# EAGLE design goodfetrep20 (EAGLE 5.04)
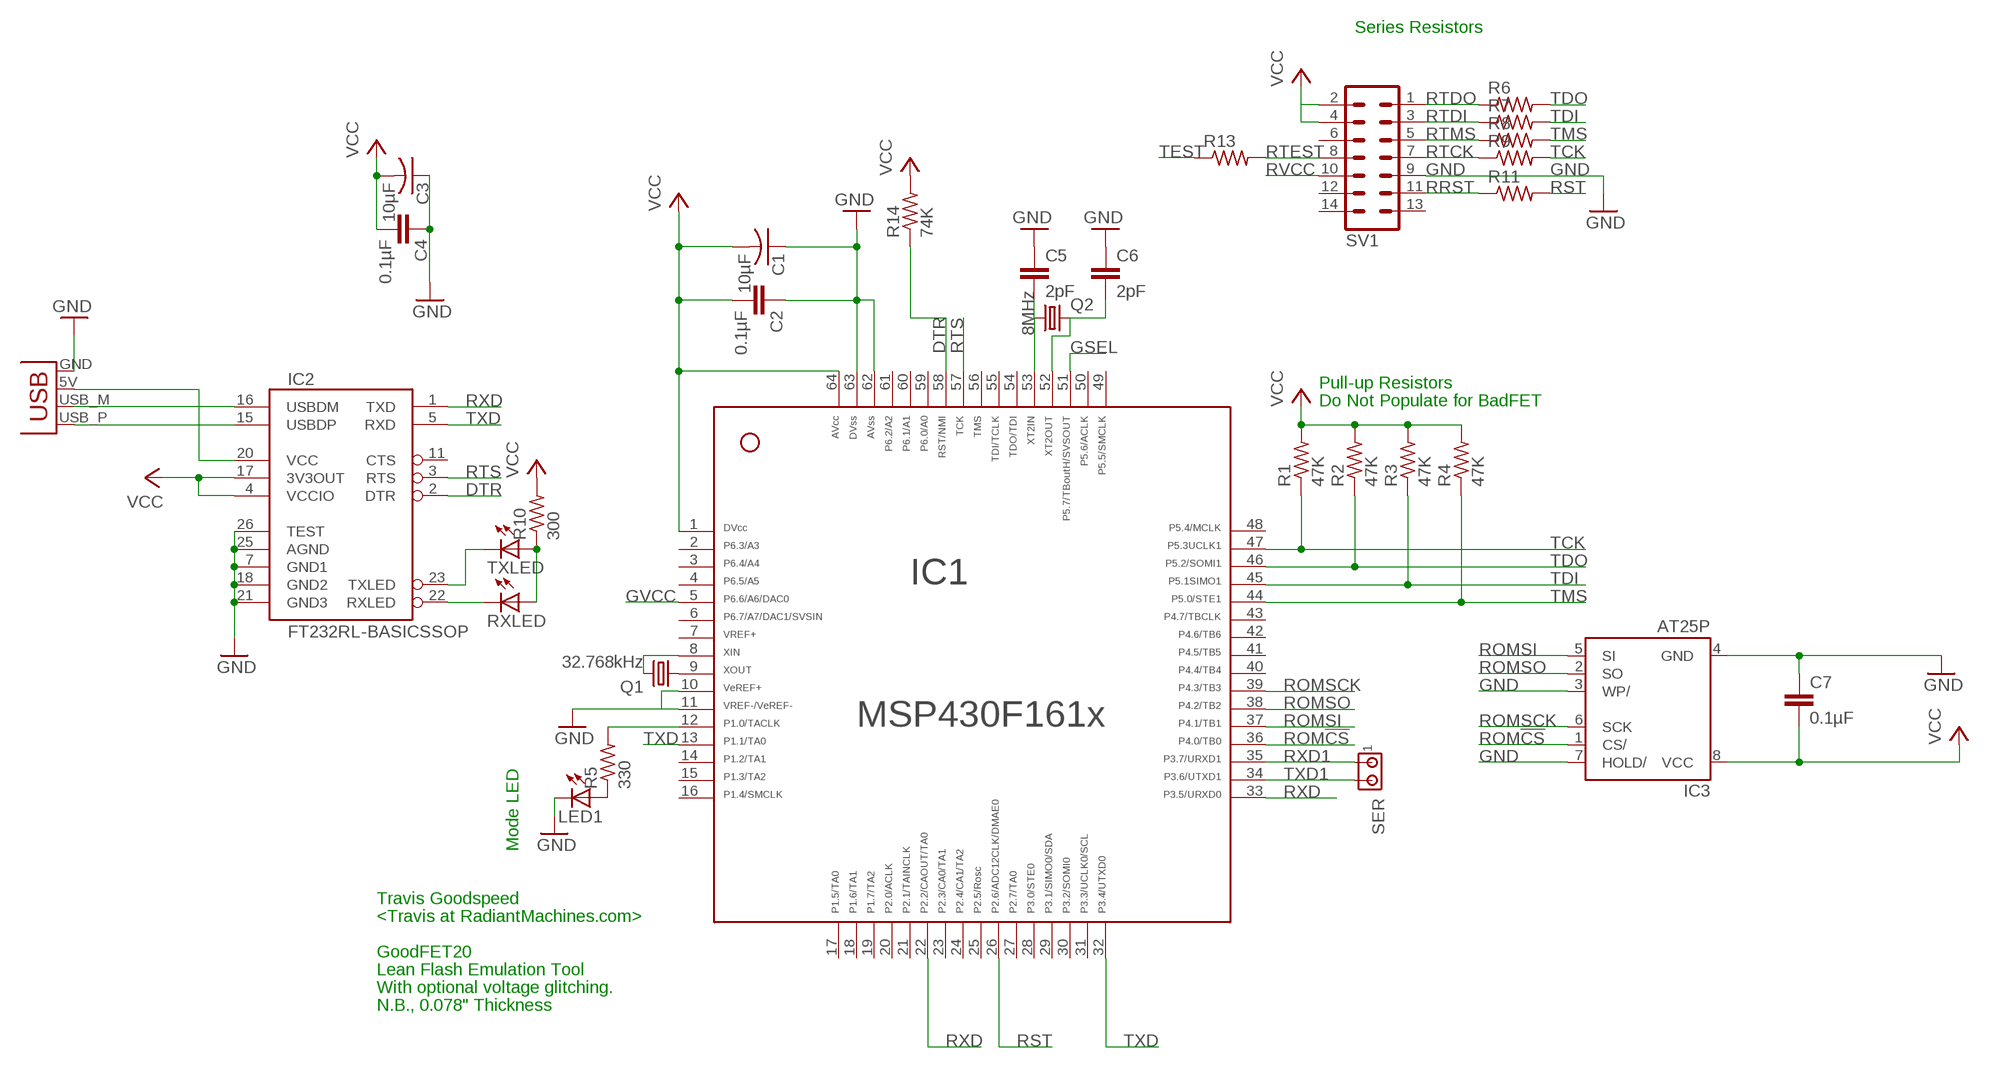
[diagram p0: schematic, sheet 1]

## Parts
C1  10µF  C-USC0603  [C0603]
C2  0.1µF  C-EUC0603  [C0603]
C3  10µF  C-USC0603  [C0603]
C4  0.1µF  C-EUC0603  [C0603]
C5  2pF  C-EUC0603  [C0603]
C6  2pF  C-EUC0603  [C0603]
C7  0.1µF  C-EUC0603  [C0603]
IC1  F161X---PM64  [PM/PAG64]
IC2  FT232RL-BASICSSOP  [SSOP28DB]
IC3  AT25P  [DIL08]
LED1  LEDCHIP-LED0603  [CHIP-LED0603]
Q1  32.768kHz  CRYSTALTC26V  [TC26V]
Q2  8MHz  CRYSTALTC26V  [TC26V]
R1  47K  R-US_R0603  [R0603]
R2  47K  R-US_R0603  [R0603]
R3  47K  R-US_R0603  [R0603]
R4  47K  R-US_R0603  [R0603]
R5  330  R-US_R0603  [R0603]
R6  R-US_R0603  [R0603]
R7  R-US_R0603  [R0603]
R8  R-US_R0603  [R0603]
R9  R-US_R0603  [R0603]
R10  300  R-US_R0603  [R0603]
R11  R-US_R0603  [R0603]
R13  R-US_R0603  [R0603]
R14  74K  R-US_R0603  [R0603]
RXLED  LEDCHIP-LED0603  [CHIP-LED0603]
SER  MTA02-100  [10X02MTA]
SV1  MA07-2  [MA07-2]
TXLED  LEDCHIP-LED0603  [CHIP-LED0603]
X1  USBPCB  [USB-A-PCB]

## Nets
DTR: IC1.58 IC2.2(DTR) R14.1
GND: C1.1 C2.1 C3.1 C4.1 C5.1 C6.1 C7.1 IC1.10 IC1.11 IC1.62 IC1.63 IC2.7(GND1) IC2.18(GND2) IC2.21(GND3) IC2.25(AGND) IC2.26(TEST) IC3.3(WP/) IC3.4(GND) IC3.7(HOLD/) LED1.C SV1.9 X1.GND
GSEL: IC1.51
GVCC: IC1.5
N$1: IC1.12 R5.2
N$2: LED1.A R5.1
N$3: IC2.15(USBDP) X1.USB_P(D+)
N$4: IC2.16(USBDM) X1.USB_M(D-)
N$5: IC2.20(VCC) X1.5V(VBUS)
N$6: IC2.22(RXLED) RXLED.C
N$7: IC2.23(TXLED) TXLED.C
N$8: R10.1 RXLED.A TXLED.A
N$9: IC1.9 Q1.1
N$10: C5.2 IC1.53 Q2.1
N$14: C6.2 IC1.52 Q2.2
N$21: IC1.8 Q1.2
ROM!CS: IC1.36 IC3.1(CS/)
ROMSCK: IC1.39 IC3.6(SCK)
ROMSI: IC1.37 IC3.5(SI)
ROMSO: IC1.38 IC3.2(SO)
RRST: R11.1 SV1.11
RST: IC1.26 R11.2
RTCK: R9.1 SV1.7
RTDI: R7.1 SV1.3
RTDO: R6.1 SV1.1
RTEST: R13.2 SV1.8
RTMS: R8.1 SV1.5
RTS: IC1.57 IC2.3(RTS)
RVCC: SV1.10
RXD: IC1.22 IC1.33 IC2.1(TXD)
RXD1: IC1.35 SER.1
TCK: IC1.47 R1.1 R9.2
TDI: IC1.45 R3.1 R7.2
TDO: IC1.46 R2.1 R6.2
TEST: R13.1
TMS: IC1.44 R4.1 R8.2
TXD: IC1.13 IC1.32 IC2.5(RXD)
TXD1: IC1.34 SER.2
VCC: C1.2 C2.2 C3.2 C4.2 C7.2 IC1.1 IC1.64 IC2.4(VCCIO) IC2.17(3V3OUT) IC3.8(VCC) R1.2 R2.2 R3.2 R4.2 R10.2 R14.2 SV1.2 SV1.4
Unconnected: IC1.2 IC1.3 IC1.4 IC1.6 IC1.7 IC1.14 IC1.15 IC1.16 IC1.17 IC1.18 IC1.19 IC1.20 IC1.21 IC1.23 IC1.24 IC1.25 IC1.27 IC1.28 IC1.29 IC1.30 IC1.31 IC1.40 IC1.41 IC1.42 IC1.43 IC1.48 IC1.49 IC1.50 IC1.54 IC1.55 IC1.56 IC1.59 IC1.60 IC1.61 IC2.11(CTS) SV1.6 SV1.12 SV1.13 SV1.14

## Notes on the sheet
- Series Resistors
- Pull-up Resistors
- Do Not Populate for BadFET
- Mode LED
- Travis Goodspeed
- <Travis at RadiantMachines.com>
- GoodFET20
- Lean Flash Emulation Tool
- With optional voltage glitching.
- N.B., 0.078" Thickness

## Library data of the parts
C1 C3 = rcl:C-US: CAPACITOR, American symbol
C2 C4-C7 = rcl:C-EU: CAPACITOR, European symbol
IC1 = TI_MSP430_v122:F161X---PM64: *** MSP430F161x *** PM64
IC2 = SparkFun:FT232RL-BASIC: USB UART This is the simplified version of the FT232RL unit. Only what you need, nothing you don't. Spark Fun Electronics SKU : COM-00650
IC3 = atmel:AT25*: SPI bus serial EEPROM
LED1 RXLED TXLED = led:LED: LED OSRAM: - CHIPLED LG R971, LG N971, LY N971, LG Q971, LY Q971, LO R971, LY R971 LH N974, LH R974 LS Q976, LO Q976, LY Q976 LO Q996 - Hyper CHIPLED LW Q18S LB Q993, LB Q99A, LB R99A - SideLED LS A670, LO A670, LY A670, LG A670, LP A670 LB A673, LV A673, LT A673, LW A673 LH A674 LY A675 LS A676, LA A676, LO A676, LY A676, LW A676 LS A679, LY A679, LG A679 - Hyper Micro SIDELED® LS Y876, LA Y876, LO Y876, LY Y876 LT Y87S - SmartLED LW L88C, LW L88S LB L89C, LB L89S, LG L890 LS L89K, LO L89K, LY L89K LS L896, LA L896, LO L896, LY L896 - TOPLED LS T670, LO T670, LY T670, LG T670, LP T670 LSG T670, LSP T670, LSY T670, LOP T670, LYG T670 LG T671, LOG T671, LSG T671 LB T673, LV T673, LT T673, LW T673 LH T674 LS T676, LA T676, LO T676, LY T676, LB T676, LH T676, LSB T676, LW T676 LB T67C, LV T67C, LT T67C, LS T67K, LO T67K, LY T67K, LW E67C LS E67B, LA E67B, LO E67B, LY E67B, LB E67C, LV E67C, LT E67C LW T67C LS T679, LY T679, LG T679 LS T770, LO T770, LY T770, LG T770, LP T770 LB T773, LV T773, LT T773, LW T773 LH T774 LS E675, LA E675, LY E675, LS T675 LS T776, LA T776, LO T776, LY T776, LB T776 LHGB T686 LT T68C, LB T68C - Hyper Mini TOPLED® LB M676 - Mini TOPLED Santana® LG M470 LS M47K, LO M47K, LY M47K Source: http://www.osram.convergy.de LUXEON: - LUMILED® LXK2-PW12-R00, LXK2-PW12-S00, LXK2-PW14-U00, LXK2-PW14-V00 LXK2-PM12-R00, LXK2-PM12-S00, LXK2-PM14-U00 LXK2-PE12-Q00, LXK2-PE12-R00, LXK2-PE12-S00, LXK2-PE14-T00, LXK2-PE14-U00 LXK2-PB12-K00, LXK2-PB12-L00, LXK2-PB12-M00, LXK2-PB14-N00, LXK2-PB14-P00, LXK2-PB14-Q00 LXK2-PR12-L00, LXK2-PR12-M00, LXK2-PR14-Q00, LXK2-PR14-R00 LXK2-PD12-Q00, LXK2-PD12-R00, LXK2-PD12-S00 LXK2-PH12-R00, LXK2-PH12-S00 LXK2-PL12-P00, LXK2-PL12-Q00, LXK2-PL12-R00 Source: www.luxeon.com KINGBRIGHT: KA-3528ASYC Source: www.kingbright.com
Q1 Q2 = crystal:CRYSTAL: CRYSTAL
R1-R5 R10 R14 = rcl:R-US_: RESISTOR, American symbol
R6-R9 R11 R13 = resistor:R-US_: RESISTOR, American symbol
SER = con-amp:MTA02-100: AMP connector
SV1 = con-lstb:MA07-2: PIN HEADER
X1 = SparkFun:USB: USB Connectors USB-B-PTH is fully proven SKU : PRT-00139 USB-miniB is fully proven SKU : PRT-00587 USB-A-PCB is untested. USB-A-H is throughly reviewed, but untested. Spark Fun Electronics SKU : PRT-00437 USB-B-SMT is throughly reviewed, but untested. Needs silkscreen touching up. USB-A-S has not been used/tested USB-MB-H has not been used/tested

## Board
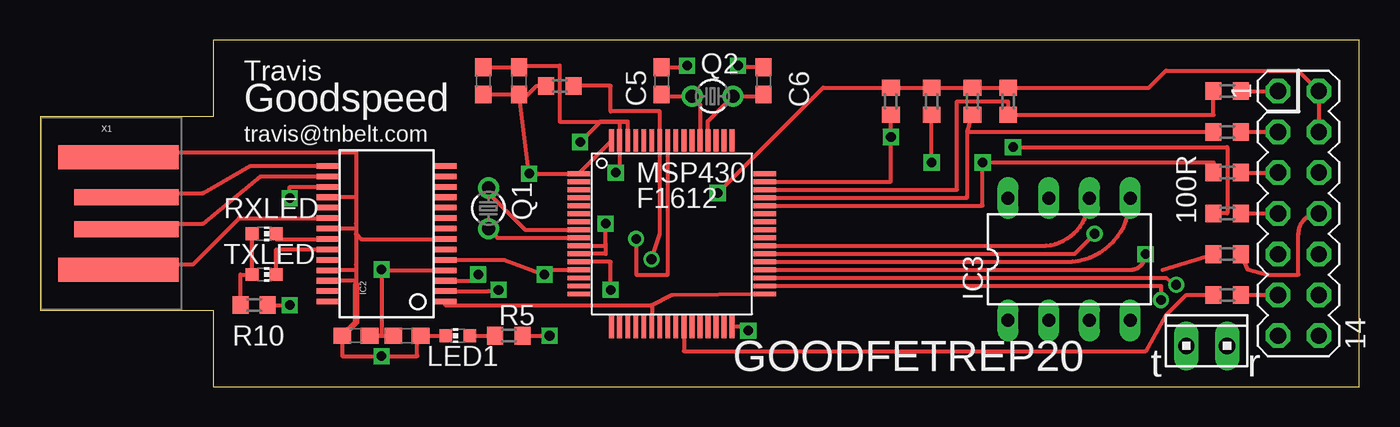
[diagram p1: board, top side]
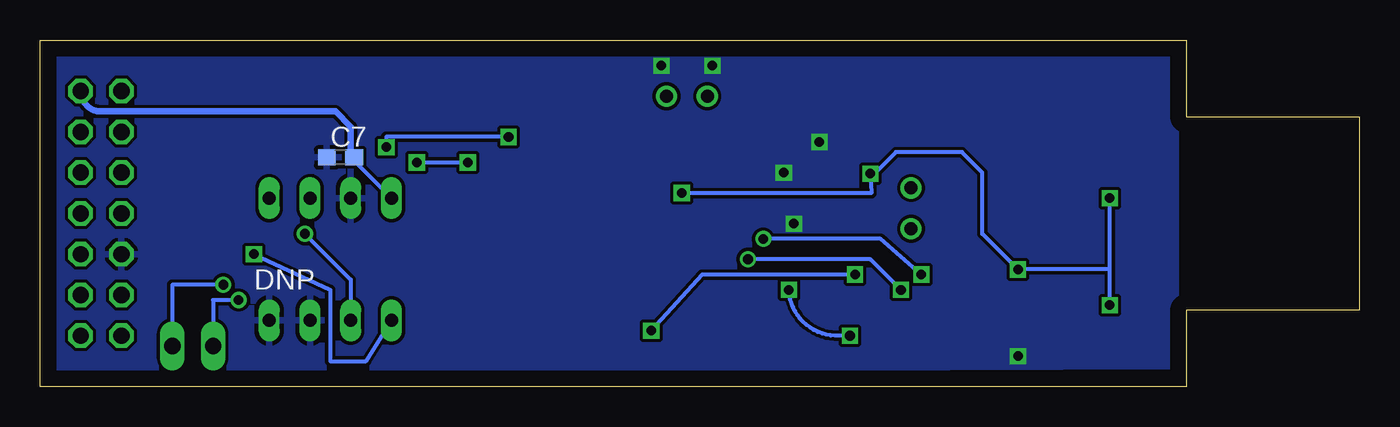
[diagram p2: board, bottom side, seen from below]

Size 82.22 x 21.59 mm. Coordinates in mm from the lower left corner, seen from the top.
Outline: 10.79,0 82.22,0 82.22,21.59 10.79,21.59 10.79,16.83 0,16.83 0,4.76 10.79,4.76 10.79,0
Copper layers (1*16): Top 0.035mm / dielectric 1.5mm / Bottom 0.035mm
Design rules "default *": minimum track width 10mil, minimum drill 10mil, track to track 8mil, track to pad 8mil, pad to pad 4mil, via to via 8mil, smd to smd 8mil, copper to edge 40mil, drill to drill 8mil, minimum pad ring 10mil, minimum via ring 8mil, stop-mask expansion 4mil, vias tented up to drill 0mil, thermal gap 10mil

### Footprints (pad centres in the part's own frame; a part is rotated, then mirrored left to right if it is on the bottom)
C0603 = smd 1.1 x 1: 1 -0.85,0; 2 0.85,0
PM/PAG64 = smd 1.4 x 0.3: 1 -5.8,3.75; 2 -5.8,3.25; 3 -5.8,2.75; 4 -5.8,2.25; 5 -5.8,1.75; 6 -5.8,1.25; 7 -5.8,0.75; 8 -5.8,0.25; 9 -5.8,-0.25; 10 -5.8,-0.75; 11 -5.8,-1.25; 12 -5.8,-1.75; 13 -5.8,-2.25; 14 -5.8,-2.75; 15 -5.8,-3.25; 16 -5.8,-3.75; 33 5.8,-3.75; 34 5.8,-3.25; 35 5.8,-2.75; 36 5.8,-2.25; 37 5.8,-1.75; 38 5.8,-1.25; 39 5.8,-0.75; 40 5.8,-0.25; 41 5.8,0.25; 42 5.8,0.75; 43 5.8,1.25; 44 5.8,1.75; 45 5.8,2.25; 46 5.8,2.75; 47 5.8,3.25; 48 5.8,3.75 | smd 0.3 x 1.4: 17 -3.75,-5.8; 18 -3.25,-5.8; 19 -2.75,-5.8; 20 -2.25,-5.8; 21 -1.75,-5.8; 22 -1.25,-5.8; 23 -0.75,-5.8; 24 -0.25,-5.8; 25 0.25,-5.8; 26 0.75,-5.8; 27 1.25,-5.8; 28 1.75,-5.8; 29 2.25,-5.8; 30 2.75,-5.8; 31 3.25,-5.8; 32 3.75,-5.8; 49 3.75,5.8; 50 3.25,5.8; 51 2.75,5.8; 52 2.25,5.8; 53 1.75,5.8; 54 1.25,5.8; 55 0.75,5.8; 56 0.25,5.8; 57 -0.25,5.8; 58 -0.75,5.8; 59 -1.25,5.8; 60 -1.75,5.8; 61 -2.25,5.8; 62 -2.75,5.8; 63 -3.25,5.8; 64 -3.75,5.8
SSOP28DB = smd 0.348 x 1.397: 1 -4.225,-3.656; 2 -3.575,-3.656; 3 -2.925,-3.656; 4 -2.275,-3.656; 5 -1.625,-3.656; 6 -0.975,-3.656; 7 -0.325,-3.656; 8 0.325,-3.656; 9 0.975,-3.656; 10 1.625,-3.656; 11 2.275,-3.656; 12 2.925,-3.656; 13 3.575,-3.656; 14 4.225,-3.656; 15 4.225,3.656; 16 3.575,3.656; 17 2.925,3.656; 18 2.275,3.656; 19 1.625,3.656; 20 0.975,3.656; 21 0.325,3.656; 22 -0.325,3.656; 23 -0.975,3.656; 24 -1.625,3.656; 25 -2.275,3.656; 26 -2.925,3.656; 27 -3.575,3.656; 28 -4.225,3.656
DIL08 = drill 0.813 long: 1 -3.81,-3.81; 2 -1.27,-3.81; 3 1.27,-3.81; 4 3.81,-3.81; 5 3.81,3.81; 6 1.27,3.81; 7 -1.27,3.81; 8 -3.81,3.81
CHIP-LED0603 = smd 0.8 x 0.8: A 0,-0.75; C 0,0.75
TC26V = drill 0.813 round: 1 -1.27,0; 2 1.27,0
R0603 = smd 1 x 1.1: 1 -0.85,0; 2 0.85,0
10X02MTA = drill 1.016 long: 1 1.27,0; 2 -1.27,0
MA07-2 = drill 1.016 octagon: 1 -7.62,-1.27; 2 -7.62,1.27; 3 -5.08,-1.27; 4 -5.08,1.27; 5 -2.54,-1.27; 6 -2.54,1.27; 7 0,-1.27; 8 0,1.27; 9 2.54,-1.27; 10 2.54,1.27; 11 5.08,-1.27; 12 5.08,1.27; 13 7.62,-1.27; 14 7.62,1.27
USB-A-PCB = smd 7.5 x 1.5: 5V -0.2,-3.5; GND -0.2,3.5 | smd 6.5 x 1: USB_M 0.3,-1; USB_P 0.3,1

### Placement (x,y rotation side)
C1  27.62,19.05 270 top
C2  29.85,19.05 270 top
C3  19.68,3.18 0 top
C4  22.86,3.18 180 top
C5  38.73,19.05 270 top
C6  45.09,19.05 270 top
C7  63.5,14.29 0 bottom
IC1  39.37,9.53 0 top
IC2  21.59,9.53 90 top
IC3  64.13,7.94 0 top
LED1  26.04,3.18 90 top
Q1  27.94,11.11 90 top
Q2  41.91,18.1 0 top
R1  53.02,17.78 90 top
R2  60.32,17.78 90 top
R3  58.1,17.78 90 top
R4  55.56,17.78 90 top
R5  29.21,3.18 0 top
R6  73.98,18.42 180 top
R7  73.98,15.88 180 top
R8  73.98,13.33 180 top
R9  73.98,10.79 180 top
R10  13.33,5.08 0 top
R11  73.98,5.71 180 top
R13  73.98,8.25 0 top
R14  32.39,18.73 180 top
RXLED  13.97,9.53 270 top
SER  72.71,2.54 0 top
SV1  78.42,10.79 270 top
TXLED  13.97,6.99 270 top
X1  5.08,10.79 0 top

### Tracks (layer width: path | path; a pad name or v marks a point on that pad's centre or on a via)
DTR  (via drill 0.6)
  Top 0.254: IC2.2 27.94,5.95 v28.57,6.03 | v38.1,7.94 38.62,9.53 IC1.58 38.62,17.14 35.56,17.14 35.56,18.73 R14.1
  Bottom 0.254: v28.57,6.03 30.48,7.94 v38.1,7.94
GND  (via drill 0.6)
  Top 0.254: 19.68,11.8 19.68,14.61 5.2,14.61 X1.GND | 19.68,11.8 IC2.18 | 19.68,11.8 19.68,10.16 | 19.68,10.16 19.68,9.53 | 19.68,9.53 19.68,7.62 | 19.68,7.62 19.68,6.6 | 19.68,6.6 IC2.26 | 19.68,6.6 19.68,6.35 | IC2.25 19.68,7.25 19.68,7.62 | IC2.21 19.68,9.85 19.68,10.16 | C3.1 18.83,1.91 v21.27,1.91 23.49,1.91 23.49,3.18 C4.1 LED1.C | IC2.7 20.01,9.2 19.68,9.53 | C1.1 C2.1 29.85,20 32.39,20 32.39,16.51 36.12,16.51 | 36.12,16.51 IC1.63 36.12,13.58 v35.88,13.33 | 36.62,16.51 IC1.62 | 36.12,16.51 36.62,16.51 | C6.1 43.92,19.9 v43.5,20 | C5.1 40.22,19.9 v40.32,20 | 36.62,16.51 34.93,16.51 v33.66,15.24 | 35.24,8.89 v35.24,10.16 | 35.24,8.89 35.24,8.28 IC1.11 | IC1.10 35.24,8.78 35.24,8.89
  Top 0.406: 19.68,6.35 19.68,4.03 C3.1
  Bottom 0.254: v33.66,15.24 33.34,15.24 | v35.88,13.33 36.2,13.33
  pour Bottom: 11.75,20.96 81.6,20.64 81.91,0.95 11.43,1.27 11.43,20.64
N$1  (via drill 0.6)
  Top 0.254: R5.2 v31.75,3.18 | v35.56,6.03 35.56,7.78 IC1.12
  Bottom 0.254: v31.75,3.18 32.39,3.18 arc90 v35.56,6.03
N$2
  Top 0.254: LED1.A R5.1
N$3
  Top 0.254: IC2.15 13.11,13.75 10.16,12.07 5.65,12.07 X1.USB_P
N$4
  Top 0.254: IC2.16 13.73,13.1 10.16,10.16 5.75,10.16 X1.USB_M
N$5
  Top 0.254: IC2.20 12.4,10.5 9.52,7.62 5.2,7.62 X1.5V
N$6
  Top 0.254: IC2.22 14.72,9.2 RXLED.C
N$7
  Top 0.254: IC2.23 14.72,8.55 TXLED.C
N$8
  Top 0.254: RXLED.A TXLED.A 12.48,6.99 R10.1
N$9
  Top 0.254: IC1.9 28.51,9.28 Q1.1
N$10
  Top 0.254: IC1.53 41.12,17.62 Q2.1 39.16,18.1 C5.2
N$14
  Top 0.254: IC1.52 41.62,16.54 Q2.2 44.66,18.1 C6.2
N$21
  Top 0.254: IC1.8 30.23,9.78 27.94,12.07 Q1.2
ROM!CS  (via drill 0.6)
  Top 0.254: IC1.36 67.92,7.28 arc90 v68.9,8.25
  Bottom 0.254: v68.9,8.25 64.13,6.03 64.13,1.59 61.91,1.59 IC3.1
ROMSCK
  Top 0.254: IC1.39 62.43,8.78 arc90 IC3.6
ROMSI
  Top 0.254: IC1.37 63.97,7.78 arc90 IC3.5
ROMSO  (via drill 0.6)
  Top 0.254: IC1.38 64.47,8.28 v65.72,9.53
  Bottom 0.254: v65.72,9.53 62.87,6.67 IC3.2
RRST
  Top 0.254: R11.1 SV1.11
RST
  Top 0.254: IC1.26 40.12,2.22 68.9,2.22 70.17,4.45 71.44,5.71 R11.2
RTCK
  Top 0.254: R9.1 SV1.7
RTDI
  Top 0.254: R7.1 SV1.3
RTDO
  Top 0.254: R6.1 SV1.1
RTEST
  Top 0.254: R13.2 75.25,7.3 76.52,6.99 78.42,6.99 78.42,9.53 arc-90 SV1.8
RTMS
  Top 0.254: R8.1 SV1.5
RTS  (via drill 0.6)
  Top 0.254: IC2.3 27.3,6.6 v27.3,6.99 | v37.15,9.21 37.15,6.99 39.12,6.99 IC1.57
  Bottom 0.254: v27.3,6.99 29.85,9.21 v37.15,9.21
RXD
  Top 0.254: IC2.1 25.25,5.08 38.1,5.08 | 38.1,5.08 39.4,5.71 IC1.33 | IC1.22 38.12,5.08 38.1,5.08
RXD1  (via drill 0.6)
  Top 0.254: IC1.35 70.17,6.78 v70.8,6.35
  Bottom 0.254: v70.8,6.35 73.98,6.35 SER.1
TCK  (via drill 0.6)
  Top 0.254: IC1.47 53.02,12.78 v53.02,15.56 R1.1 | 73.34,10.79 R9.2 73.98,10.79 73.98,14.92 v60.64,14.92
  Bottom 0.254: v60.64,14.92 60.64,15.56 v53.02,15.56
TDI
  Top 0.254: 57.79,15.88 R7.2 | 57.79,15.88 R3.1 | IC1.45 57.79,11.78 57.79,15.88
TDO
  Top 0.254: R6.2 73.13,16.93 R2.1 60.32,17.78 57.15,17.78 57.15,12.28 IC1.46
TEST
  Top 0.254: 69.95,7.28 R13.1
TMS  (via drill 0.6)
  Top 0.254: IC1.44 58.74,11.28 v58.74,13.97 73.13,13.97 R8.2 | v55.56,13.97 R4.1
  Bottom 0.254: v58.74,13.97 v55.56,13.97
TXD  (via drill 0.6)
  Top 0.254: IC1.32 44.37,3.72 v44.13,3.49 | IC2.5 28.93,7.9 v31.43,6.99 31.75,7.28 IC1.13
  Bottom 0.254: v44.13,3.49 40.96,6.99 v31.43,6.99
TXD1  (via drill 0.6)
  Top 0.254: IC1.34 69.85,6.28 v69.85,5.4
  Bottom 0.254: v69.85,5.4 71.44,5.4 SER.2
VCC  (via drill 0.6)
  Top 0.254: C4.2 C3.2 21.27,3.18 v21.27,7.3 21.27,7.25 IC2.4 | 29.91,17.71 C2.2 C1.2 | 29.91,17.71 v30.48,13.28 IC1.1 IC1.64 | SV1.4 SV1.2 78.42,19.68 70.17,19.68 69.11,18.63 R2.2 R3.2 R4.2 R1.2 48.79,18.63 v42.23,12.07 | R14.2 30.93,18.73 29.91,17.71 | IC2.17 15.56,12.45 v15.56,11.75 | R10.2 v15.56,5.08
  Bottom 0.254: v15.56,5.08 15.56,7.3 | 15.56,7.3 v15.56,11.75 | 15.56,7.3 v21.27,7.3 23.49,9.53 23.49,13.33 24.76,14.61 28.89,14.61 30.22,13.28 v30.48,13.28 30.42,12.07 v42.23,12.07 | C7.2 62.65,14.07 IC3.8
  Bottom 0.406: C7.2 62.87,14.5 62.87,16.19 63.82,17.14 78.42,17.14 arc90 SV1.2

### Text on the board
tPlace: Travis | Goodspeed | travis@tnbelt.com | 100R | GOODFETREP20
tNames: MSP430 | F1612 | t | r
bNames: DNP